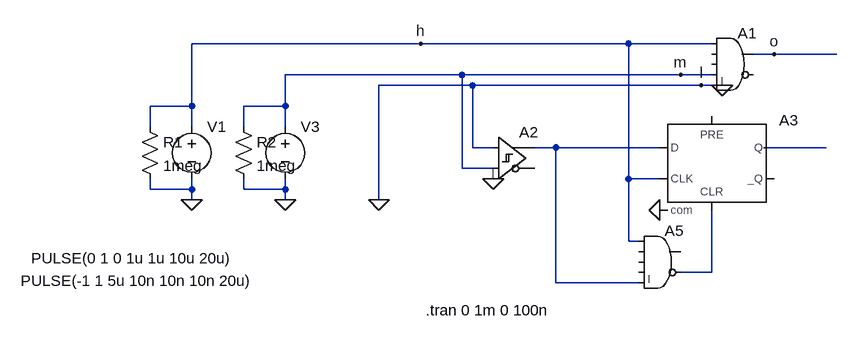
[diagram p0: schematic Draft2.asc]
Draft2.asc, the LTspice schematic file:
Version 4
SHEET 1 1364 680
WIRE -1184 224 -1184 192
WIRE -1184 320 -1184 304
WIRE -1120 192 -1184 192
WIRE -1120 192 -1120 96
WIRE -1120 224 -1120 192
WIRE -1120 320 -1184 320
WIRE -1120 320 -1120 304
WIRE -1120 336 -1120 320
WIRE -1040 224 -1040 192
WIRE -1040 320 -1040 304
WIRE -976 192 -1040 192
WIRE -976 192 -976 144
WIRE -976 224 -976 192
WIRE -976 320 -1040 320
WIRE -976 320 -976 304
WIRE -976 336 -976 320
WIRE -832 336 -832 160
WIRE -768 96 -1120 96
WIRE -704 144 -976 144
WIRE -704 288 -704 144
WIRE -688 160 -832 160
WIRE -688 256 -688 160
WIRE -656 256 -688 256
WIRE -656 288 -704 288
WIRE -560 256 -592 256
WIRE -560 464 -560 256
WIRE -448 96 -768 96
WIRE -448 304 -448 96
WIRE -448 400 -448 304
WIRE -432 400 -448 400
WIRE -432 464 -560 464
WIRE -400 256 -560 256
WIRE -400 304 -448 304
WIRE -368 144 -704 144
WIRE -336 160 -688 160
WIRE -320 96 -448 96
WIRE -320 144 -368 144
WIRE -320 160 -336 160
WIRE -320 448 -368 448
WIRE -320 448 -320 352
WIRE -224 112 -256 112
WIRE -144 256 -240 256
WIRE -128 112 -224 112
FLAG -1120 336 0
FLAG -976 336 0
FLAG -832 336 0
FLAG -304 160 0
FLAG -336 160 l
FLAG -368 144 m
FLAG -768 96 h
FLAG -224 112 o
FLAG -656 304 0
FLAG -400 352 0
SYMBOL voltage -1120 208 R0
WINDOW 3 -247 218 Left 0
WINDOW 123 0 0 Left 0
WINDOW 39 0 0 Left 0
SYMATTR Value PULSE(0 1 0 1u 1u 10u 20u)
SYMATTR InstName V1
SYMBOL res -1200 208 R0
SYMATTR InstName R1
SYMATTR Value 1meg
SYMBOL res -1056 208 R0
SYMATTR InstName R2
SYMATTR Value 1meg
SYMBOL voltage -976 208 R0
WINDOW 3 -407 253 Left 0
WINDOW 123 0 0 Left 0
WINDOW 39 0 0 Left 0
SYMATTR Value PULSE(-1 1 5u 10n 10n 10n 20u)
SYMATTR InstName V3
SYMBOL Digital\\and -288 64 R0
WINDOW 3 0 0 Invisible 0
SYMATTR Value Vt=0.1 nobreak
SYMATTR InstName A1
SYMATTR SpiceModel SERFLOP
SYMATTR Value2 trise=200n tripdt=5n
SYMBOL Digital\\diffschmitt -656 208 R0
SYMATTR InstName A2
SYMATTR Value2 Vt=0 Vh=0.1
SYMBOL Digital\\dflop -320 208 R0
SYMATTR InstName A3
SYMATTR Value2 trise=200n tripdt=5n
SYMBOL Digital\\and -400 368 R0
SYMATTR InstName A5
TEXT -760 506 Left 0 !.tran 0 1m 0 100n

The netlist it stands for:
* Draft2.asc
V1 h 0 PULSE(0 1 0 1u 1u 10u 20u)
R1 h 0 1meg
R2 m 0 1meg
V3 m 0 PULSE(-1 1 5u 10n 10n 10n 20u)
A1 h 0 0 m 0 0 o 0 SERFLOP Vt=0.1 nobreak trise=200n tripdt=5n
A2 0 m 0 0 0 0 N001 0 SCHMITT Vt=0 Vh=0.1
A3 N001 0 h 0 N002 0 N003 0 DFLOP trise=200n tripdt=5n
A5 h 0 0 0 N001 N002 0 0 AND
.tran 0 1m 0 100n
.backanno
.end